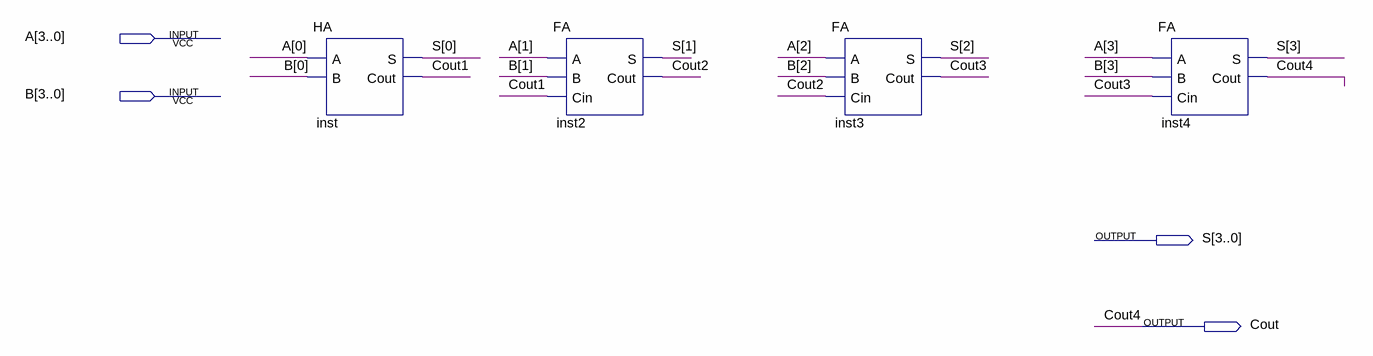
[diagram p0: schematic sheet]
// Quartus schematic lab01.bdf as structural Verilog: 4 symbols, 4 pins
module lab01 (
  input  [3:0] A,
  input  [3:0] B,
  output [3:0] S,
  output Cout
);

  wire Cout1, Cout2, Cout3;

  HA inst (.A(A[0]), .B(B[0]), .S(S[0]), .Cout(Cout1));
  FA inst2 (.A(A[1]), .B(B[1]), .Cin(Cout1), .S(S[1]), .Cout(Cout2));
  FA inst3 (.A(A[2]), .B(B[2]), .Cin(Cout2), .S(S[2]), .Cout(Cout3));
  FA inst4 (.A(A[3]), .B(B[3]), .Cin(Cout3), .S(S[3]), .Cout(Cout));

  // Other names for the same wires on the sheet: Cout4 = Cout
endmodule
